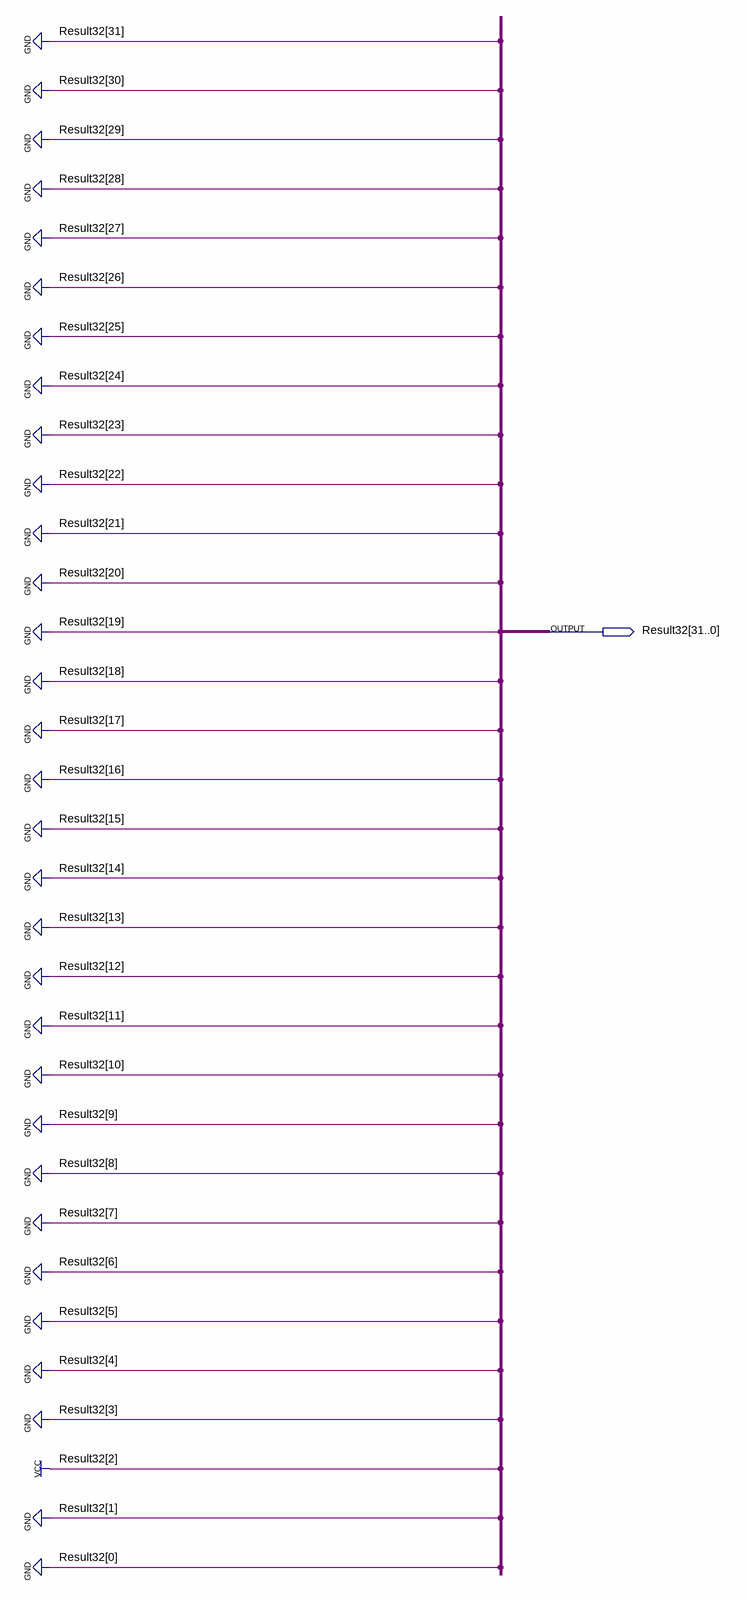
[diagram p0: schematic sheet]
// Quartus schematic four32bit.bdf as structural Verilog: 0 symbols, 1 pins
module four32bit (
  output [31:0] Result32
);


  assign Result32 = 32'b00000000000000000000000000000100;
endmodule
